# Altium project SSB25_rev0.PrjPCB (part 2 of 2)

## Sheet 8-Other_Inputs.SchDoc
size A4
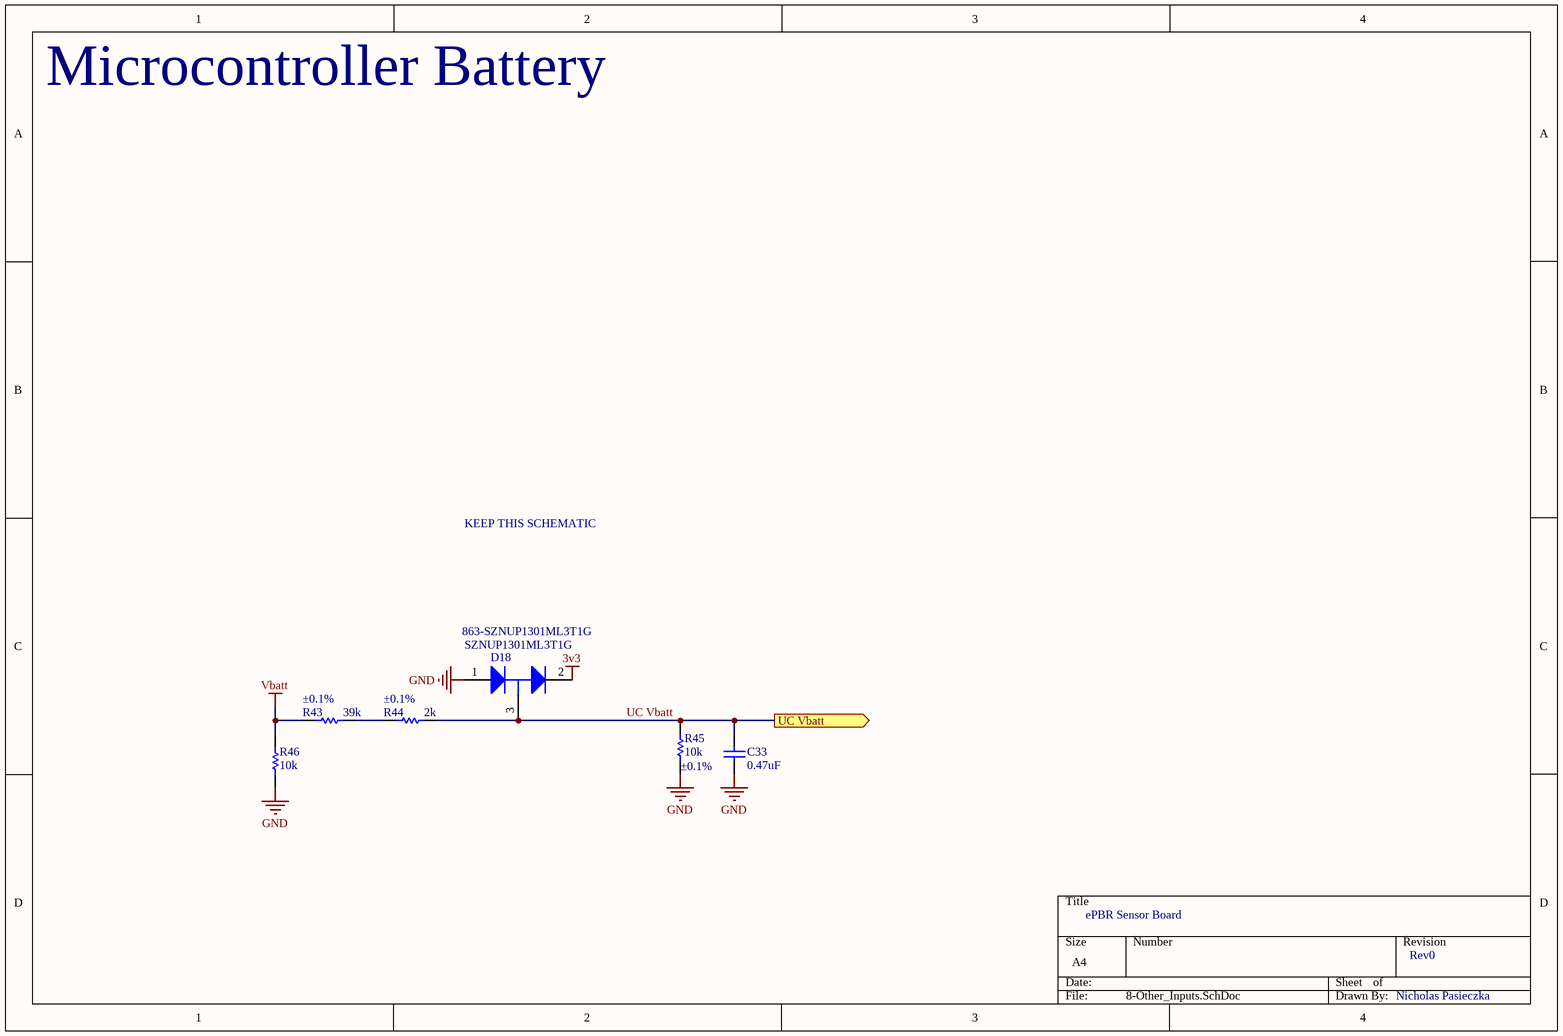
[diagram p7: 8-Other_Inputs.SchDoc]

### Parts
C33  value 0.47uF  [1608[0603]]  (hidden comment: Cap)
D18  SZNUP1301ML3T1G  Supplier Part Number 1: 863-SZNUP1301ML3T1G  [ONSC-SOT-23-3-318-08_V]
R43  value 39k  Tolerance: ±0.1%  [1608[0603]]  (hidden comment: Res1)
R44  value 2k  Tolerance: ±0.1%  [1608[0603]]  (hidden comment: Res1)
R45  value 10k  Tolerance: ±0.1%  [1608[0603]]  (hidden comment: Res1)
R46  value 10k  [1608[0603]]  (hidden comment: Res1)

### Ports
UC Vbatt (out)

### Nets
3v3: D18.2(K)
GND: C33.1 D18.1(A) R45.1 R46.1
Vbatt: R43.1 R46.2
UC Vbatt: C33.2 D18.3(K/A) R44.2 R45.2 ; port UC Vbatt
NetR43_2: R43.2 R44.1

### Notes on the sheet
- Microcontroller Battery
- KEEP THIS SCHEMATIC
- ePBR Sensor Board
- Rev0
- Nicholas Pasieczka

### Library data of the parts
C33 = Cap: Capacitor; Manufacturer: Yageo; Manufacturer Part Number: CC0603KRX7R8BB474; Capacitance: 0.47µF; Tolerance: ±10%; Voltage - Rated: 25V; Temperature Coefficient: X7R; Supplier 1: Digi-Key; Supplier Part Number 1: 311-1805-1-ND; RoHS: RoHS Compliant; Category: Capacitors; Stock 1: 11076; Pricing 1: 1=0.22, 10=0.158, 25=0.1156, 50=0.0898, 100=0.0745, 250=0.06168, 500=0.05226, 1000=0.04324 (CAD); Packaging: Cut Tape (CT); Part Status: Active; Operating Temperature: -55°C ~ 125°C; Features: -; Ratings: -; Applications: General Purpose; Failure Rate: -; Mounting Type: Surface Mount, MLCC; Package / Case: 0603 (1608 Metric); Size / Dimension: 0.063" L x 0.031" W (1.60mm x 0.80mm); Height - Seated (Max): -; Thickness (Max): 0.035" (0.90mm); Lead Spacing: -; Lead Style: -; ComponentLink1URL: http://www.yageo.com/documents/recent/UPY-GPHC_X7R_6.3V-to-50V_16.pdf; ComponentLink1Description: http://www.yageo.com/documents/recent/UPY-GPHC_X7R_6.3V-to-50V_16.pdf
D18 = CMP-1063-00171-1: Low Capacitance Diode Array for ESD Protection in a Single Data Line, 3-Pin SOT-23, Pb-Free, Tape and Reel; Manufacturer: On Semiconductor; C Max (pF): 0.9; Direction: Bidirectional; V(BR) Min (V): 70; Number of Lines: 1; Mounting Technology: Surface Mount; PackageReference: SOT-23-3-318-08; DatasheetVersion: Rev. 6; PackageVersion: Rev. AP, 11/2009; RoHS: Pb-Free; ComponentLink1Description: Manufacturer URL; ComponentLink1URL: http://www.onsemi.com/; PackageDescription: 3-Pin Small Outline Transistor, Body 2.92 x 1.3 mm, Pitch 0.95 mm; PartNumber: SZNUP1301ML3T1G; Packing: Tape and Reel; ComponentLink3URL: http://www.onsemi.cn/pub_link/Collateral/318-08.PDF; ComponentLink3Description: Package Specification; VRWM Max (V): 70; ComponentLink2Description: Datasheet; ComponentLink2URL: http://www.onsemi.cn/pub_link/Collateral/NUP1301ML3T1-D.PDF; Supplier 1: Mouser
R43 = Res1: Resistor; Manufacturer: Yageo; Manufacturer Part Number: RT0603BRD0739KL; Power (Watts): 0.1W, 1/10W; Temperature Coefficient: ±25ppm/°C; Supplier 1: Digi-Key; Supplier Part Number 1: YAG1649CT-ND; RoHS: RoHS Compliant; Category: Resistors; Stock 1: 2740; Pricing 1: 1=0.55, 10=0.464, 25=0.3376, 50=0.2446, 100=0.1814, 250=0.1392, 500=0.10966, 1000=0.07592 (CAD); Packaging: Cut Tape (CT); Part Status: Active; Resistance (Ohms): 39k; Composition: Thin Film; Features: Moisture Resistant; Operating Temperature: -55°C ~ 155°C; Package / Case: 0603 (1608 Metric); Supplier Device Package: 0603; Size / Dimension: 0.063" L x 0.031" W (1.60mm x 0.80mm); Height - Seated (Max): 0.022" (0.55mm); Number of Terminations: 2; Failure Rate: -; ComponentLink1URL: http://www.yageo.com/documents/recent/PYu-RT_1-to-0.05_RoHS_L_6.pdf; ComponentLink1Description: http://www.yageo.com/documents/recent/PYu-RT_1-to-0.05_RoHS_L_6.pdf
R44 = Res1: Resistor; Manufacturer: Yageo; Manufacturer Part Number: AT0603BRD072KL; Power (Watts): 0.1W, 1/10W; Temperature Coefficient: ±25ppm/°C; Supplier 1: Digi-Key; Supplier Part Number 1: YAG2112CT-ND; RoHS: RoHS Compliant; Category: Resistors; Stock 1: 1218; Pricing 1: 1=0.59, 10=0.431, 25=0.3188, 50=0.235, 100=0.1725, 250=0.14248, 500=0.11746, 1000=0.08498 (CAD); Packaging: Cut Tape (CT); Part Status: Active; Resistance (Ohms): 2k; Composition: Thin Film; Features: Anti-Sulfur, Automotive AEC-Q200, Moisture Resistant; Operating Temperature: -55°C ~ 155°C; Package / Case: 0603 (1608 Metric); Supplier Device Package: 0603; Size / Dimension: 0.063" L x 0.032" W (1.60mm x 0.80mm); Height - Seated (Max): 0.022" (0.55mm); Number of Terminations: 2; Failure Rate: -; ComponentLink1URL: http://www.yageo.com/documents/recent/PYu-AT_51_RoHS_L-3.pdf; ComponentLink1Description: http://www.yageo.com/documents/recent/PYu-AT_51_RoHS_L-3.pdf
R45 = Res1: Resistor; Manufacturer: Yageo; Manufacturer Part Number: RT0603BRD0710KL; Power (Watts): 0.1W, 1/10W; Temperature Coefficient: ±25ppm/°C; Supplier 1: Digi-Key; Supplier Part Number 1: YAG1236CT-ND; RoHS: RoHS Compliant; Category: Resistors; Stock 1: 2958; Pricing 1: 1=0.5, 10=0.42, 25=0.3048, 50=0.2212, 100=0.164, 250=0.12592, 500=0.0992, 1000=0.06867 (CAD); Packaging: Cut Tape (CT); Part Status: Active; Resistance (Ohms): 10k; Composition: Thin Film; Features: Moisture Resistant; Operating Temperature: -55°C ~ 155°C; Package / Case: 0603 (1608 Metric); Supplier Device Package: 0603; Size / Dimension: 0.063" L x 0.031" W (1.60mm x 0.80mm); Height - Seated (Max): 0.022" (0.55mm); Number of Terminations: 2; Failure Rate: -; ComponentLink1URL: http://www.yageo.com/documents/recent/PYu-RT_1-to-0.05_RoHS_L_6.pdf; ComponentLink1Description: http://www.yageo.com/documents/recent/PYu-RT_1-to-0.05_RoHS_L_6.pdf
R46 = Res1: Resistor; Manufacturer: Yageo; Manufacturer Part Number: RC0603JR-0710KL; Tolerance: ±5%; Power (Watts): 0.1W, 1/10W; Temperature Coefficient: ±100ppm/°C; Supplier 1: Digi-Key; Supplier Part Number 1: 311-10KGRCT-ND; RoHS: RoHS Compliant; Category: Resistors; Stock 1: 2936292; Pricing 1: 1=0.16, 10=0.016, 25=0.0112, 50=0.0084, 100=0.0062, 250=0.0048, 500=0.00382, 1000=0.00281 (CAD); Packaging: Cut Tape (CT); Part Status: Active; Resistance (Ohms): 10k; Composition: Thick Film; Features: Moisture Resistant; Operating Temperature: -55°C ~ 155°C; Package / Case: 0603 (1608 Metric); Supplier Device Package: 0603; Size / Dimension: 0.063" L x 0.031" W (1.60mm x 0.80mm); Height - Seated (Max): 0.022" (0.55mm); Number of Terminations: 2; Failure Rate: -; ComponentLink1URL: http://www.yageo.com/NewPortal/yageodocoutput?fileName=/pdf/R-Chip/PYu-RC_Group_51_RoHS_L_4.pdf; ComponentLink1Description: http://www.yageo.com/NewPortal/yageodocoutput?fileName=/pdf/R-Chip/PYu-RC_Group_51_RoHS_L_4.pdf

## Sheet 9-Potentiometers.SchDoc
size A4
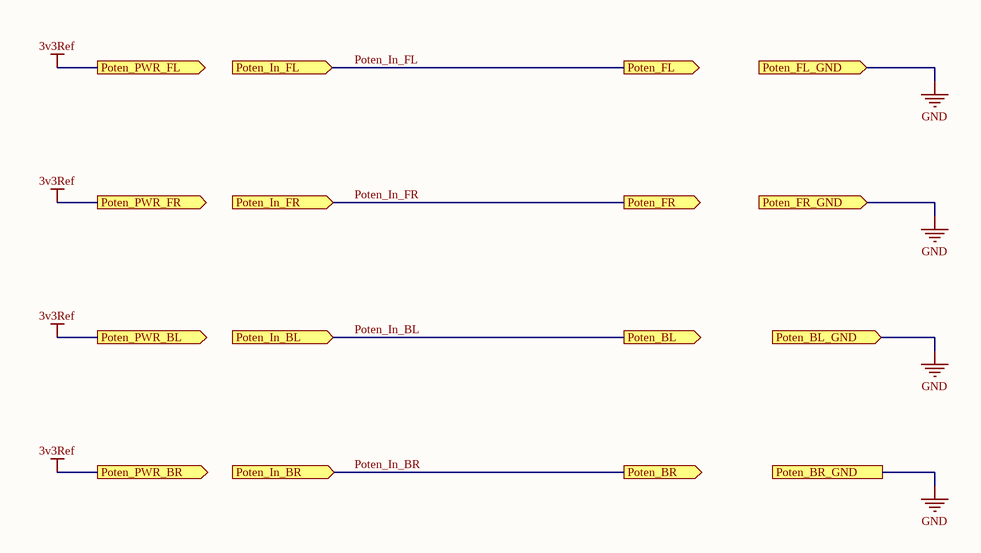
[diagram p8: 9-Potentiometers.SchDoc]

### Ports
Poten_BL (out), Poten_BL_GND (in), Poten_BR (out), Poten_BR_GND, Poten_FL (out), Poten_FL_GND (in), Poten_FR (out), Poten_FR_GND (in), Poten_In_BL (in), Poten_In_BR (in), Poten_In_FL (in), Poten_In_FR (in), Poten_PWR_BL (out), Poten_PWR_BR (out), Poten_PWR_FL (out), Poten_PWR_FR (out)

### Nets
3v3Ref: port Poten_PWR_FL, port Poten_PWR_FR, port Poten_PWR_BL, port Poten_PWR_BR
GND: port Poten_FL_GND, port Poten_FR_GND, port Poten_BL_GND, port Poten_BR_GND
Poten_In_BL: port Poten_In_BL, port Poten_BL
Poten_In_BR: port Poten_In_BR, port Poten_BR
Poten_In_FL: port Poten_In_FL, port Poten_FL
Poten_In_FR: port Poten_In_FR, port Poten_FR

## Sheet 10-Cooling Sensors.SchDoc
size A4
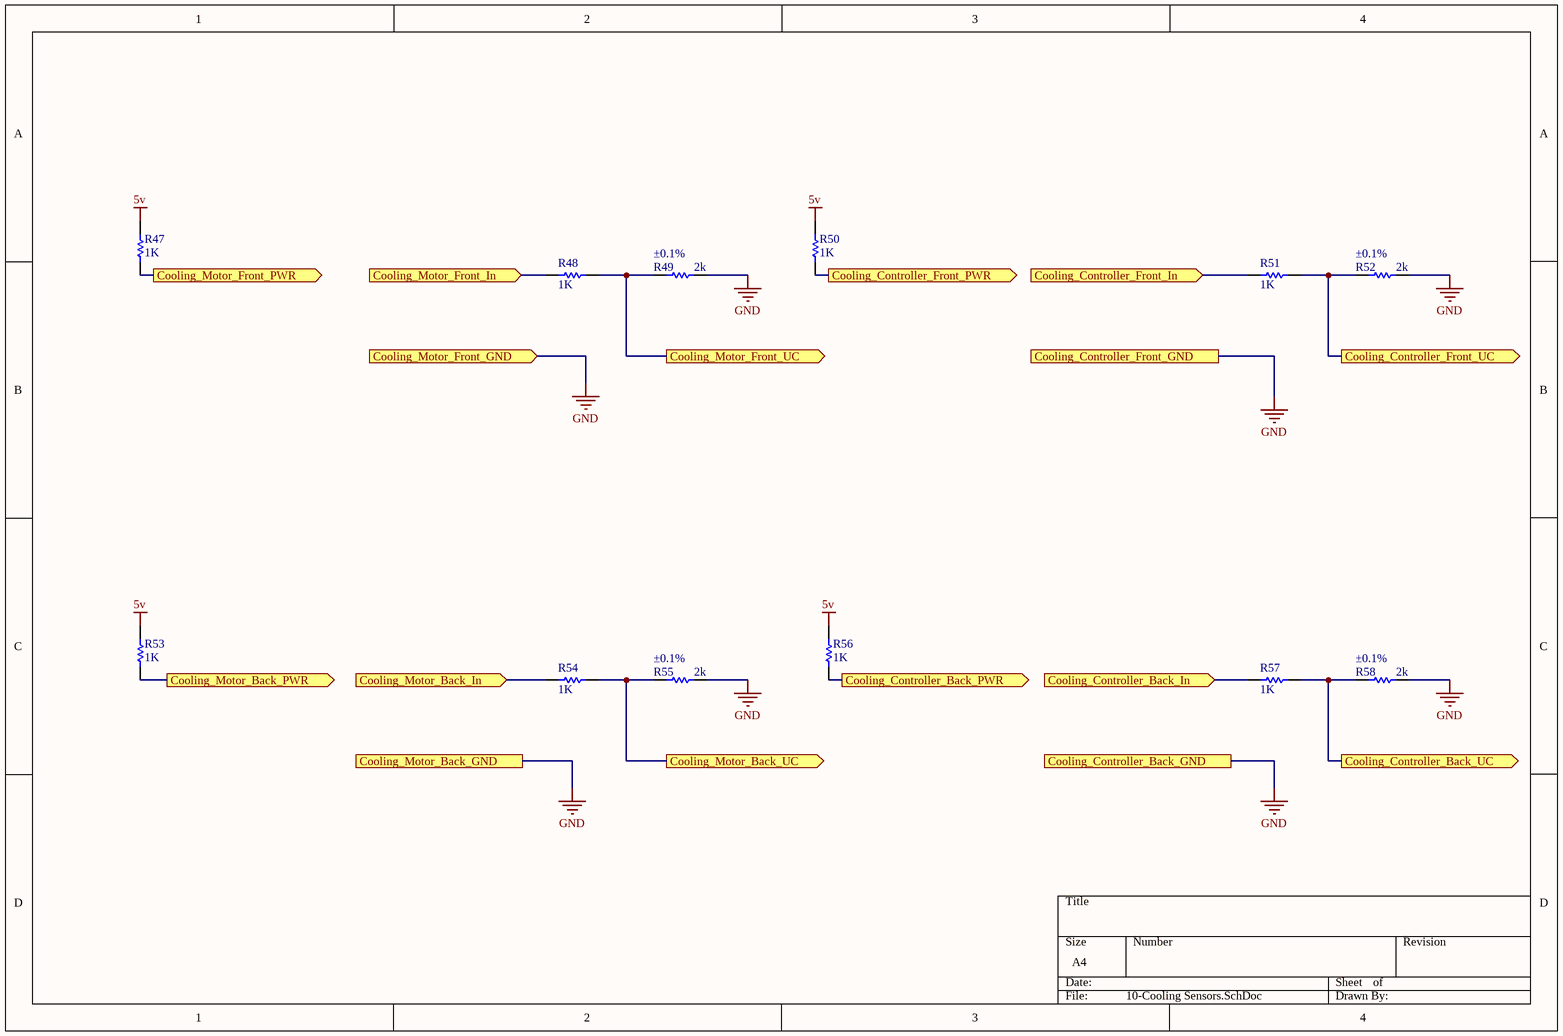
[diagram p9: 10-Cooling Sensors.SchDoc]

### Parts
R47  value 1K  [1608[0603]]  (hidden comment: Res1)
R48  value 1K  [1608[0603]]  (hidden comment: Res1)
R49  value 2k  Tolerance: ±0.1%  [1608[0603]]  (hidden comment: Res1)
R50  value 1K  [1608[0603]]  (hidden comment: Res1)
R51  value 1K  [1608[0603]]  (hidden comment: Res1)
R52  value 2k  Tolerance: ±0.1%  [1608[0603]]  (hidden comment: Res1)
R53  value 1K  [1608[0603]]  (hidden comment: Res1)
R54  value 1K  [1608[0603]]  (hidden comment: Res1)
R55  value 2k  Tolerance: ±0.1%  [1608[0603]]  (hidden comment: Res1)
R56  value 1K  [1608[0603]]  (hidden comment: Res1)
R57  value 1K  [1608[0603]]  (hidden comment: Res1)
R58  value 2k  Tolerance: ±0.1%  [1608[0603]]  (hidden comment: Res1)

### Ports
Cooling_Controller_Back_GND, Cooling_Controller_Back_In (in), Cooling_Controller_Back_PWR (out), Cooling_Controller_Back_UC (out), Cooling_Controller_Front_GND, Cooling_Controller_Front_In (in), Cooling_Controller_Front_PWR (out), Cooling_Controller_Front_UC (out), Cooling_Motor_Back_GND, Cooling_Motor_Back_In (in), Cooling_Motor_Back_PWR (out), Cooling_Motor_Back_UC (out), Cooling_Motor_Front_GND (in), Cooling_Motor_Front_In (in), Cooling_Motor_Front_PWR (out), Cooling_Motor_Front_UC (out)

### Nets
5v: R47.2 R50.2 R53.2 R56.2
GND: R49.2 R52.2 R55.2 R58.2 ; port Cooling_Controller_Front_GND, port Cooling_Controller_Back_GND, port Cooling_Motor_Front_GND, port Cooling_Motor_Back_GND
NetR47_1: R47.1 ; port Cooling_Motor_Front_PWR
NetR48_1: R48.1 R49.1 ; port Cooling_Motor_Front_UC
NetR48_2: R48.2 ; port Cooling_Motor_Front_In
NetR50_1: R50.1 ; port Cooling_Controller_Front_PWR
NetR51_1: R51.1 R52.1 ; port Cooling_Controller_Front_UC
NetR51_2: R51.2 ; port Cooling_Controller_Front_In
NetR53_1: R53.1 ; port Cooling_Motor_Back_PWR
NetR54_1: R54.1 R55.1 ; port Cooling_Motor_Back_UC
NetR54_2: R54.2 ; port Cooling_Motor_Back_In
NetR56_1: R56.1 ; port Cooling_Controller_Back_PWR
NetR57_1: R57.1 R58.1 ; port Cooling_Controller_Back_UC
NetR57_2: R57.2 ; port Cooling_Controller_Back_In

### Library data of the parts
R47 R48 R50 R51 R53 R54 R56 R57 = Res1: Resistor; Published: 8-Jun-2000; LatestRevisionDate: 17-Jul-2002; LatestRevisionNote: Re-released for DXP Platform.; PackageReference: AXIAL-0.3; Publisher: Altium Limited; PackageDescription: Axial Device, Thru-Hole; 2 Leads; 0.3 in Pin Spacing
R49 R52 R55 R58 = Res1: as R44 on sheet 8-Other_Inputs; Supplier 1: Digi-Key; Supplier Part Number 1: YAG2112CT-ND; RoHS: RoHS Compliant; Category: Resistors; Stock 1: 1218; Pricing 1: 1=0.59, 10=0.431, 25=0.3188, 50=0.235, 100=0.1725, 250=0.14248, 500=0.11746, 1000=0.08498 (CAD); Packaging: Cut Tape (CT); Part Status: Active; Resistance (Ohms): 2k; Composition: Thin Film; Features: Anti-Sulfur, Automotive AEC-Q200, Moisture Resistant; Operating Temperature: -55°C ~ 155°C; Package / Case: 0603 (1608 Metric); Supplier Device Package: 0603; Size / Dimension: 0.063" L x 0.032" W (1.60mm x 0.80mm); Height - Seated (Max): 0.022" (0.55mm); Number of Terminations: 2; Failure Rate: -; ComponentLink1URL: http://www.yageo.com/documents/recent/PYu-AT_51_RoHS_L-3.pdf; ComponentLink1Description: http://www.yageo.com/documents/recent/PYu-AT_51_RoHS_L-3.pdf

## Sheet 11-Flow meter.SchDoc
size A4
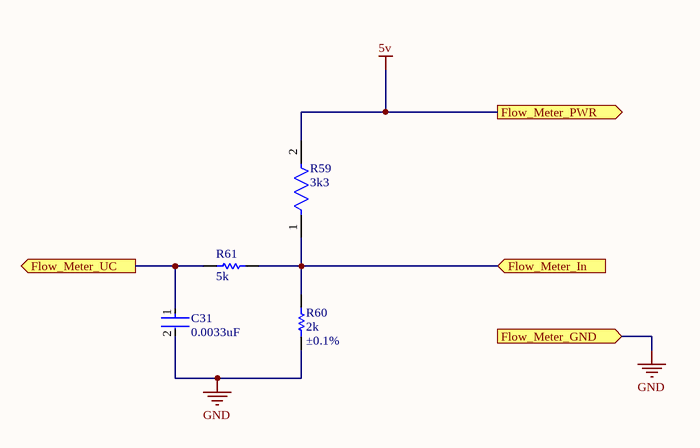
[diagram p10: 11-Flow meter.SchDoc]

### Parts
C31  0.0033uF  [FP-GRM188-0_1-e0_2_0_5-IPC_A]
R59  3k3  [FP-RC0603-0_55-MFG]
R60  value 2k  Tolerance: ±0.1%  [1608[0603]]  (hidden comment: Res1)
R61  value 5k  [1608[0603]]  (hidden comment: Res1)

### Ports
Flow_Meter_GND (in), Flow_Meter_In (in), Flow_Meter_PWR (out), Flow_Meter_UC (out)

### Nets
5v: R59.2 ; port Flow_Meter_PWR
GND: C31.2 R60.1 ; port Flow_Meter_GND
NetC31_1: C31.1 R61.2 ; port Flow_Meter_UC
NetR59_1: R59.1 R60.2 R61.1 ; port Flow_Meter_In

### Library data of the parts
C31 = CMP-2006-02467-2: Chip Multilayer Ceramic Capacitors for General Purpose, 0603, 3300pF, C0G, 30ppm/°C, 5%, 50V; Capacitance: 3.3nF; Max Operating Temperature: 125°C; Voltage Rating (DC): 50V; Termination: SMD/SMT; Packaging: Tape and Reel; Tolerance: 5%; Lead Free: Lead Free; Width: 0.031inch; Thickness: 0.035inch; REACH SVHC: No SVHC; Dielectric: C0G; Min Operating Temperature: -55°C; Material: Ceramic; Voltage Rating: 50V; Case/Package: 0603; Length: 1.6mm; Voltage: 50V; Case Code (Imperial): 0603; Radiation Hardening: No; Case Code (Metric): 1608; Mount: Surface Mount; Height: 0.8mm; Package Quantity: 4000; Depth: 0.8mm
R59 = CMP-1012-00567-3: NexarPartId: 40011875; Tolerance: 1%; Power Rating: 100mW; Temperature Coefficient: 100ppm/°C; Voltage Rating (DC): 50V; Resistance: 3.3kΩ; Military Standard: Not; Case/Package: 0603; Mount: Surface Mount; Lead Free: Lead Free; Packaging: Tape & Reel; Termination: SMD/SMT; Number of Terminations: 2; Composition: Thick Film; Length: 1.6mm; Max Power Dissipation: 100mW; Width: 800µm; Features: Moisture Resistant; Max Operating Temperature: 155°C; Depth: 800µm; Number of Pins: 2; REACH SVHC: No SVHC; Case Code (Imperial): 0603; Case Code (Metric): 0603; RoHS: Compliant; Voltage Rating (AC): 50V; Voltage Rating: 50V; Schedule B: 8533210045, 8533210045; Min Operating Temperature: -55°C; Height: 450µm
R60 = Res1: as R44 on sheet 8-Other_Inputs; Supplier 1: Digi-Key; Supplier Part Number 1: YAG2112CT-ND; RoHS: RoHS Compliant; Category: Resistors; Stock 1: 1218; Pricing 1: 1=0.59, 10=0.431, 25=0.3188, 50=0.235, 100=0.1725, 250=0.14248, 500=0.11746, 1000=0.08498 (CAD); Packaging: Cut Tape (CT); Part Status: Active; Resistance (Ohms): 2k; Composition: Thin Film; Features: Anti-Sulfur, Automotive AEC-Q200, Moisture Resistant; Operating Temperature: -55°C ~ 155°C; Package / Case: 0603 (1608 Metric); Supplier Device Package: 0603; Size / Dimension: 0.063" L x 0.032" W (1.60mm x 0.80mm); Height - Seated (Max): 0.022" (0.55mm); Number of Terminations: 2; Failure Rate: -; ComponentLink1URL: http://www.yageo.com/documents/recent/PYu-AT_51_RoHS_L-3.pdf; ComponentLink1Description: http://www.yageo.com/documents/recent/PYu-AT_51_RoHS_L-3.pdf
R61 = Res1: Resistor; Manufacturer: Yageo; Manufacturer Part Number: AT0603BRD072KL; Resistance (Ohms): 2k; Power (Watts): 0.1W, 1/10W; Temperature Coefficient: ±25ppm/°C; Supplier 1: Digi-Key; Supplier Part Number 1: YAG2112CT-ND; RoHS: RoHS Compliant; Category: Resistors; Stock 1: 1218; Pricing 1: 1=0.59, 10=0.431, 25=0.3188, 50=0.235, 100=0.1725, 250=0.14248, 500=0.11746, 1000=0.08498 (CAD); Packaging: Cut Tape (CT); Part Status: Active; Composition: Thin Film; Features: Anti-Sulfur, Automotive AEC-Q200, Moisture Resistant; Operating Temperature: -55°C ~ 155°C; Package / Case: 0603 (1608 Metric); Supplier Device Package: 0603; Size / Dimension: 0.063" L x 0.032" W (1.60mm x 0.80mm); Height - Seated (Max): 0.022" (0.55mm); Number of Terminations: 2; Failure Rate: -; ComponentLink1URL: http://www.yageo.com/documents/recent/PYu-AT_51_RoHS_L-3.pdf; ComponentLink1Description: http://www.yageo.com/documents/recent/PYu-AT_51_RoHS_L-3.pdf

## Nets that join several sheets
3v3: 1-Controller (15 pins), 2-Power (C18.2 R7.1 REG2.3), 3-CAN (C19.2 C24.2 U2.3 U3.3), 4-Connector (5 pins), 5-Brake Temp Sensors (R80.2 R81.2 R82.2 R83.2), 6-Wheel Sensors (8 pins), 8-Other_Inputs (D18.2)
3v3Ref: 1-Controller (C3.2 U1.21), 2-Power (C11.2 Ref1.6)
5v: 2-Power (C14.2 R6.1 REG1.3), 5-Brake Temp Sensors (8 pins), 10-Cooling Sensors (R47.2 R50.2 R53.2 R56.2), 11-Flow meter (R59.2)
GND: 1-Controller (23 pins), 2-Power (15 pins), 3-CAN (6 pins), 4-Connector (8 pins), 5-Brake Temp Sensors (12 pins), 6-Wheel Sensors (12 pins), 8-Other_Inputs (C33.1 D18.1 R45.1 R46.1), 10-Cooling Sensors (R49.2 R52.2 R55.2 R58.2), 11-Flow meter (C31.2 R60.1)
SSB Power: 2-Power (Q1.3), 7-Fusing (F8.2)
Vbatt: 2-Power (10 pins), 8-Other_Inputs (R43.1 R46.2)
ADC123_IN0: 1-Controller (U1.23), 4-Connector (CN1.16)
ADC123_IN1: 1-Controller (U1.24), 4-Connector (CN1.13)
ADC123_IN5: 1-Controller (U1.30), 4-Connector (CN1.10)
ADC123_IN6: 1-Controller (U1.31), 4-Connector (CN1.11)
ADC123_IN10: 1-Controller (U1.15), 4-Connector (CN1.24)
ADC123_IN11: 1-Controller (U1.16), 4-Connector (CN1.20)
ADC123_IN14: 1-Controller (U1.33), 4-Connector (CN1.15)
ADC123_IN15: 1-Controller (U1.34), 4-Connector (CN1.12)
CAN Rx: 1-Controller (U1.95), 3-CAN (R9.2)
CAN Tx: 1-Controller (U1.96), 3-CAN (R10.2)
CAN_N: 3-CAN (D4.2 R11.1 U2.6), 4-Connector (CN1.22)
CAN_P: 3-CAN (D4.1 R11.2 U2.7), 4-Connector (CN1.23)
FL_WHEEL_S_µC: 1-Controller (U1.85), 4-Connector (CN1.37), 6-Wheel Sensors (5 pins)
FR_WHEEL_S_µC: 1-Controller (U1.84), 4-Connector (CN1.34), 6-Wheel Sensors (5 pins)
GLV Power In: 4-Connector (CN1.19), 7-Fusing (F8.1)
I2C2_SDA: 1-Controller (U1.80), 4-Connector (CN1.32)
I2C2_SMBA: 1-Controller (U1.51), 4-Connector (CN1.31)
NetCN1_1: 1-Controller (U1.83), 4-Connector (CN1.1)
NetCN1_2: 1-Controller (U1.79), 4-Connector (CN1.2)
NetCN1_3: 1-Controller (U1.65), 4-Connector (CN1.3)
NetCN1_4: 1-Controller (U1.35), 4-Connector (CN1.4)
NetCN1_5: 1-Controller (U1.36), 4-Connector (CN1.5)
NetCN1_6: 1-Controller (U1.37), 4-Connector (CN1.6)
NRST: 1-Controller (C1.2 U1.14), 4-Connector (D9.3 F5.1)
RL_WHEEL_S_µC: 1-Controller (U1.82), 4-Connector (CN1.35), 6-Wheel Sensors (5 pins)
RR_WHEEL_S_µC: 1-Controller (U1.81), 4-Connector (CN1.38), 6-Wheel Sensors (5 pins)
Sensor CAN Rx: 1-Controller (U1.91), 3-CAN (R28.2)
Sensor CAN Tx: 1-Controller (U1.92), 3-CAN (R29.2)
Sensor_CAN_N: 3-CAN (D21.2 R30.1 U3.6), 4-Connector (CN1.26)
Sensor_CAN_P: 3-CAN (D21.1 R30.2 U3.7), 4-Connector (CN1.27)
SWDIO: 1-Controller (U1.72), 4-Connector (D23.3 F3.1)
UC SWCLK: 1-Controller (U1.76), 4-Connector (D11.3 F7.1)
UC SWO: 1-Controller (U1.89), 4-Connector (D10.3 F6.1)
UC Vbatt: 1-Controller (U1.32), 8-Other_Inputs (C33.2 D18.3 R44.2 R45.2)